# EAGLE design MasterHMI (EAGLE 9.3.2)
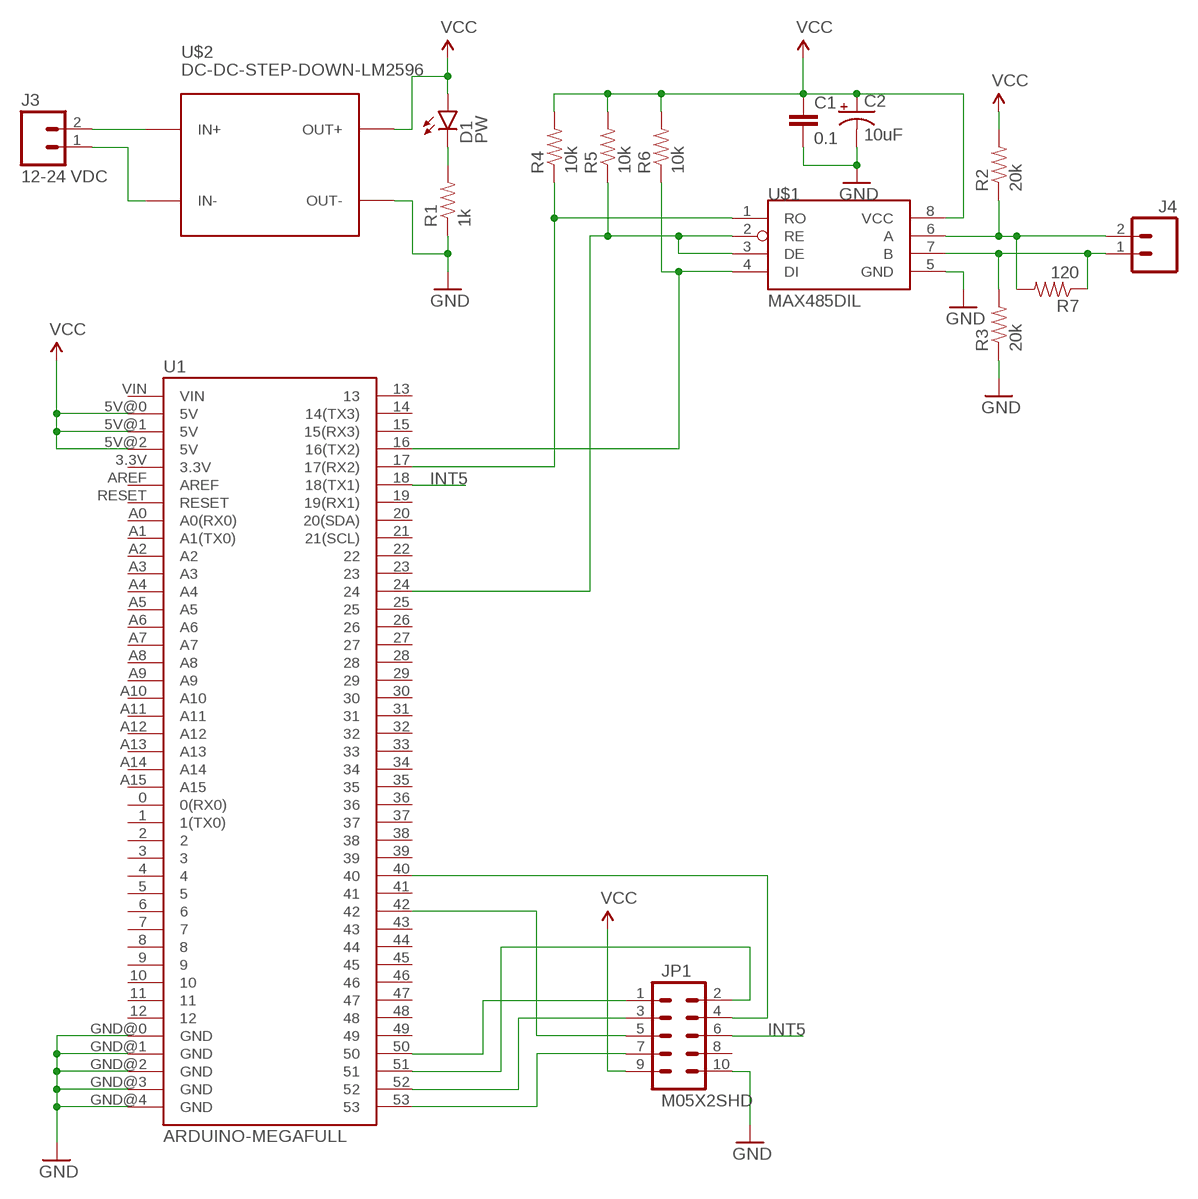
[diagram p0: schematic, sheet 1]

## Parts
C1  0.1  CAPPTH1  [CAP-PTH-5MM]
C2  10uF  CAP_POLPTH2  [CPOL-RADIAL-10UF-25V]
D1  PW  LED3MM  [LED3MM]
J3  12-24 VDC  M025MM  [SCREWTERMINAL-5MM-2]
J4  M025MM  [SCREWTERMINAL-5MM-2]
JP1  M05X2SHD  [2X5-SHROUDED]
R1  1k  RESISTORAXIAL-0.3  [AXIAL-0.3]
R2  20k  RESISTORAXIAL-0.3  [AXIAL-0.3]
R3  20k  RESISTORAXIAL-0.3  [AXIAL-0.3]
R4  10k  RESISTORAXIAL-0.3  [AXIAL-0.3]
R5  10k  RESISTORAXIAL-0.3  [AXIAL-0.3]
R6  10k  RESISTORAXIAL-0.3  [AXIAL-0.3]
R7  120  RESISTORAXIAL-0.3  [AXIAL-0.3]
U1  ARDUINO-MEGAFULL  [ARDUINO_MEGA]
U$1  MAX485DIL  [DIL08]
U$2  DC-DC-STEP-DOWN-LM2596  [DC-DC-STEP-DOWN-LM2596]

## Nets
GND: C1.2 C2.2(-) JP1.10 R1.P$1 R3.P$1 U1.GND@0(GND) U1.GND@1(GND) U1.GND@2(GND) U1.GND@3(GND) U1.GND@4(GND) U$1.5(GND) U$2.OUT-
INT5: JP1.6 U1.18(18(TX1))
N$1: J3.2 U$2.IN+
N$2: J3.1 U$2.IN-
N$3: J4.2 R2.P$1 R7.P$2 U$1.6(A)
N$4: J4.1 R3.P$2 R7.P$1 U$1.7(B)
N$5: D1.K(C) R1.P$2
N$6: JP1.1 U1.50
N$7: JP1.2 U1.51
N$8: R4.P$1 U1.17(17(RX2)) U$1.1(RO)
N$9: R6.P$1 U1.16(16(TX2)) U$1.4(DI)
N$10: JP1.3 U1.52
N$12: JP1.7 U1.53
N$13: JP1.5 U1.42
N$14: R5.P$1 U1.24 U$1.2(RE) U$1.3(DE)
N$15: JP1.4 U1.40
VCC: C1.1 C2.1(+) D1.A JP1.9 R2.P$2 R4.P$2 R5.P$2 R6.P$2 U1.5V@0(5V) U1.5V@1(5V) U1.5V@2(5V) U$1.8(VCC) U$2.OUT+
Unconnected: JP1.8 U1.0(0(RX0)) U1.1(1(TX0)) U1.2 U1.3 U1.3.3V U1.4 U1.5 U1.6 U1.7 U1.8 U1.9 U1.10 U1.11 U1.12 U1.13 U1.14(14(TX3)) U1.15(15(RX3)) U1.19(19(RX1)) U1.20(20(SDA)) U1.21(21(SCL)) U1.22 U1.23 U1.25 U1.26 U1.27 U1.28 U1.29 U1.30 U1.31 U1.32 U1.33 U1.34 U1.35 U1.36 U1.37 U1.38 U1.39 U1.41 U1.43 U1.44 U1.45 U1.46 U1.47 U1.48 U1.49 U1.A0(A0(RX0)) U1.A1(A1(TX0)) U1.A2 U1.A3 U1.A4 U1.A5 U1.A6 U1.A7 U1.A8 U1.A9 U1.A10 U1.A11 U1.A12 U1.A13 U1.A14 U1.A15 U1.AREF U1.RESET U1.VIN

## Library data of the parts
C1 = SparkFun-Capacitors:CAP: Capacitor Standard 0603 ceramic capacitor, and 0.1" leaded capacitor.
C2 = SparkFun-Capacitors:CAP_POL: Capacitor Polarized These are standard SMD and PTH capacitors. Normally 10uF, 47uF, and 100uF in electrolytic and tantalum varieties. Always verify the external diameter of the through hole cap, it varies with capacity, voltage, and manufacturer. The EIA devices should be standard.
D1 = SparkFun-LED:LED: LEDs Standard schematic elements and footprints for 5mm, 3mm, 1206, and 0603 sized LEDs. 5mm - Spark Fun Electronics SKU : COM-00529 (and others); PROD_ID: DIO-08794
J3 J4 = SparkFun-Connectors:M02: Standard 2-pin 0.1" header. Use with - straight break away headers ( PRT-00116) - right angle break away headers (PRT-00553) - swiss pins (PRT-00743) - machine pins (PRT-00117) - female headers (PRT-00115) Molex polarized connector foot print use with: PRT-08233 with associated crimp pins and housings. 2.54_SCREWTERM for use with PRT-10571. 3.5mm Screw Terminal footprints for PRT-08084 5mm Screw Terminal footprints for use with PRT-08432; STOREFRONT_ID: PRT-08432
JP1 = SparkFun:M05X2: Header 5x2 Standard 10-pin dual row 0.1" header. Commonly used with AVR-ISP. Use with Spark Fun Electronics SKU: PRT-00778
R1-R7 = SparkFun:RESISTOR: Resistor Basic schematic elements and footprints for 0603, 1206, and PTH resistors.
U1 = SparkFun-Boards:ARDUINO-MEGA: Arduino Mega board footprint
U$1 = SparkFun:MAX485
U$2 = diy-modules:DC-DC-STEP-DOWN-LM2596: DC/DC Step-Down Regulator based on LM2596-ADJ chip LM2596 datasheet available here: http://www.ti.com/lit/ds/symlink/lm2596.pdf Click here to find device on ebay.com <http://www.ebay.com/sch/lm2596+power+regulator>

## Board
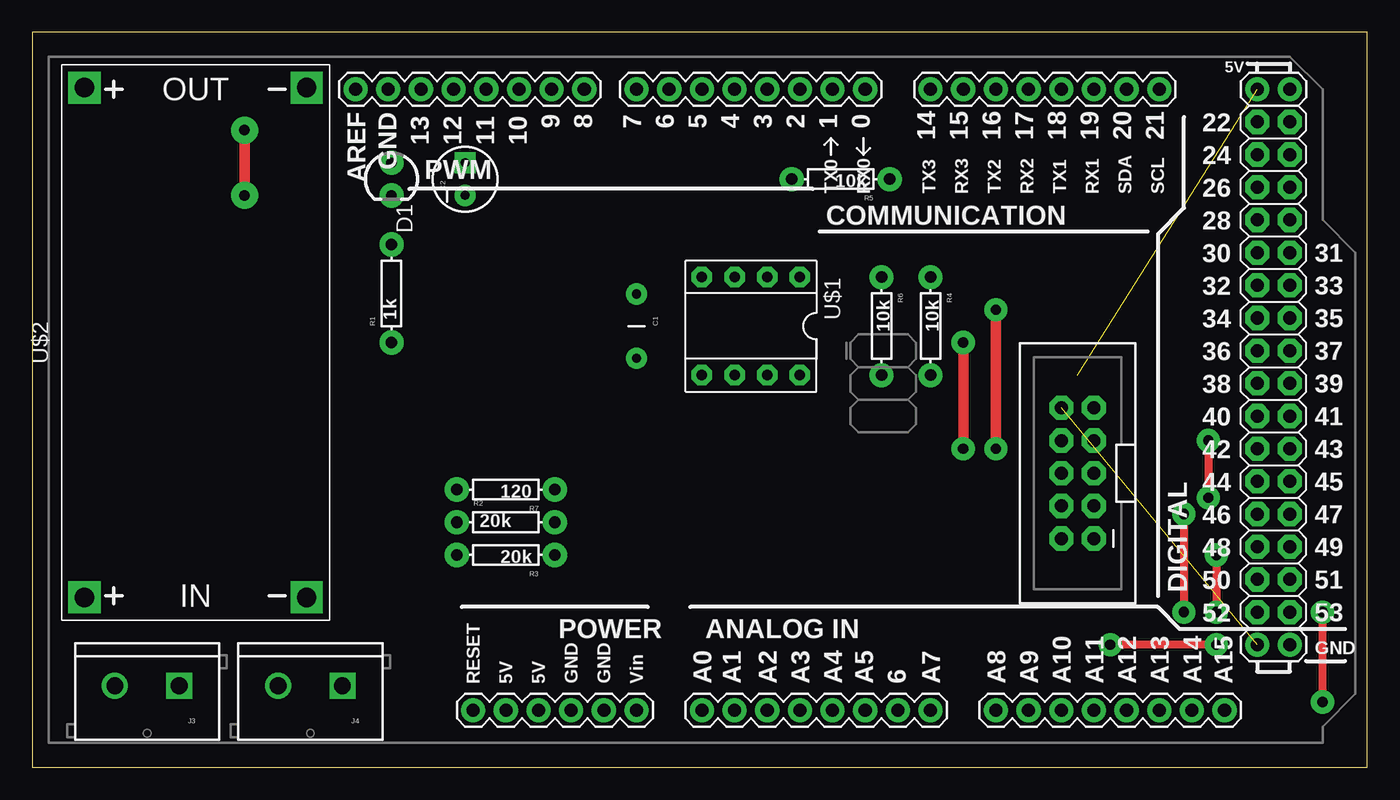
[diagram p1: board, top side]
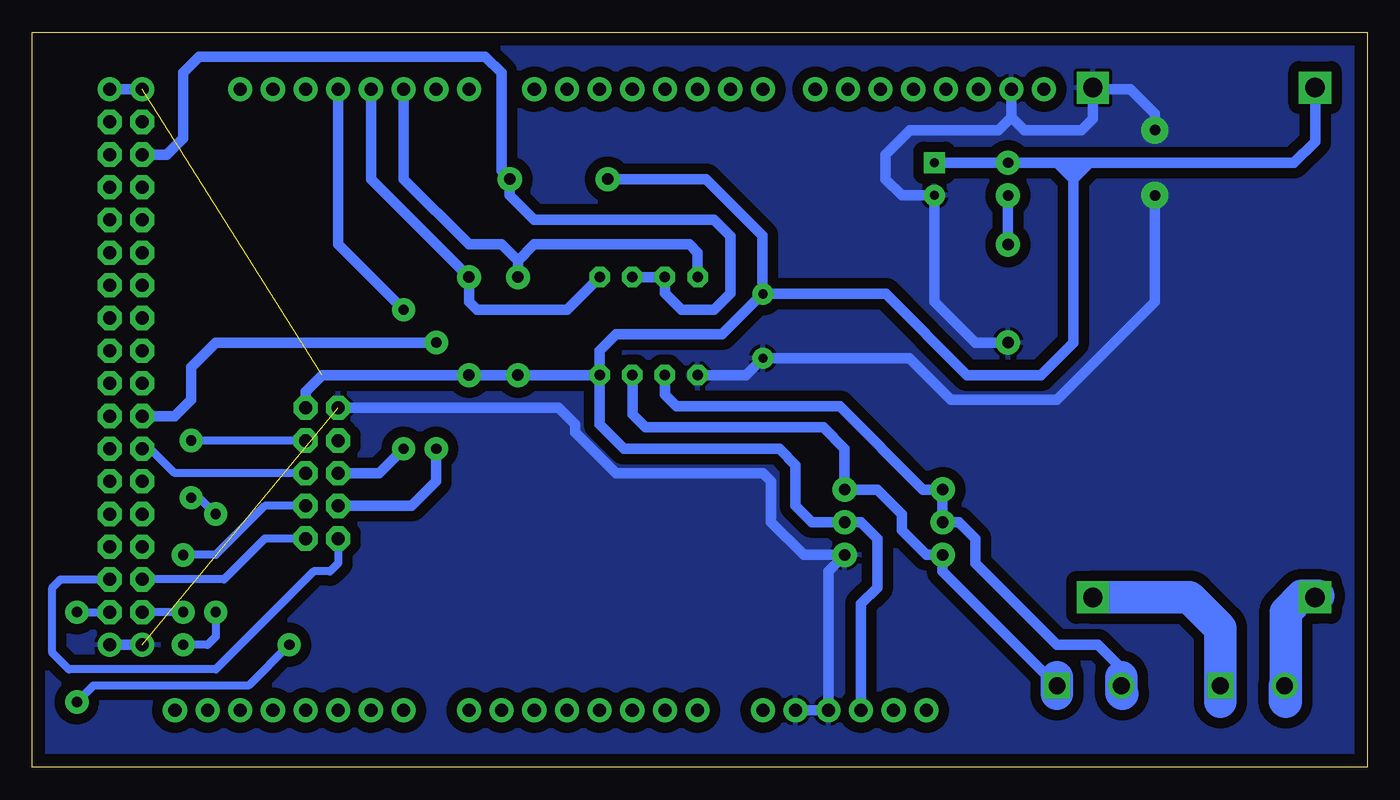
[diagram p2: board, bottom side, seen from below]

Size 103.81 x 57.14 mm. Coordinates in mm from the lower left corner, seen from the top.
Outline: 0,0 103.81,0 103.81,57.14 0,57.14 0,0
Copper layers (1*16): Top 0.035mm / dielectric 1.5mm / Bottom 0.035mm
Design rules "default": minimum track width 6mil, minimum drill 0.35mm, track to track 6mil, track to pad 6mil, pad to pad 6mil, via to via 6mil, smd to smd 6mil, copper to edge 40mil, drill to drill 6mil, minimum pad ring 10mil, minimum via ring 8mil, stop-mask expansion 4mil, vias tented up to drill 0mil, thermal gap 10mil

### Footprints (pad centres in the part's own frame; a part is rotated, then mirrored left to right if it is on the bottom)
CAP-PTH-5MM = drill 0.7 pad 1.651: 1 -2.5,0; 2 2.5,0
CPOL-RADIAL-10UF-25V = drill 0.7 pad 1.651 square: 1 1.27,0 | drill 0.7 pad 1.651: 2 -1.27,0
LED3MM = drill 0.813 pad 1.88: A -1.27,0; K 1.27,0
SCREWTERMINAL-5MM-2 = drill 1.3 pad 2.032 square: 1 0,0 | drill 1.3 pad 2.032: 2 5,0
2X5-SHROUDED = drill 1.016 pad 1.88 octagon: 1 -1.27,5.08; 2 1.27,5.08; 3 -1.27,2.54; 4 1.27,2.54; 5 -1.27,0; 6 1.27,0; 7 -1.27,-2.54; 8 1.27,-2.54; 9 -1.27,-5.08; 10 1.27,-5.08
AXIAL-0.3 = drill 0.9 pad 1.88: P$1 -3.81,0; P$2 3.81,0
ARDUINO_MEGA = drill 1.016 pad 1.88: 0 63.5,50.8; 1 60.96,50.8; 2 58.42,50.8; 3 55.88,50.8; 3.3V 35.56,2.54; 4 53.34,50.8; 5 50.8,50.8; 5V@0 38.1,2.54; 5V@1 93.98,50.8; 5V@2 96.52,50.8; 6 48.26,50.8; 7 45.72,50.8; 8 41.656,50.8; 9 39.116,50.8; 10 36.576,50.8; 11 34.036,50.8; 12 31.496,50.8; 13 28.956,50.8; 14 68.58,50.8; 15 71.12,50.8; 16 73.66,50.8; 17 76.2,50.8; 18 78.74,50.8; 19 81.28,50.8; 20 83.82,50.8; 21 86.36,50.8; A0 50.8,2.54; A1 53.34,2.54; A2 55.88,2.54; A3 58.42,2.54; A4 60.96,2.54; A5 63.5,2.54; A6 66.04,2.54; A7 68.58,2.54; A8 73.66,2.54; A9 76.2,2.54; A10 78.74,2.54; A11 81.28,2.54; A12 83.82,2.54; A13 86.36,2.54; A14 88.9,2.54; A15 91.44,2.54; AREF 23.876,50.8; GND@0 40.64,2.54; GND@1 43.18,2.54; GND@2 93.98,7.62; GND@3 96.52,7.62; GND@4 26.416,50.8; RESET 33.02,2.54; VIN 45.72,2.54 | drill 1.016 pad 1.88 octagon: 22 93.98,48.26; 23 96.52,48.26; 24 93.98,45.72; 25 96.52,45.72; 26 93.98,43.18; 27 96.52,43.18; 28 93.98,40.64; 29 96.52,40.64; 30 93.98,38.1; 31 96.52,38.1; 32 93.98,35.56; 33 96.52,35.56; 34 93.98,33.02; 35 96.52,33.02; 36 93.98,30.48; 37 96.52,30.48; 38 93.98,27.94; 39 96.52,27.94; 40 93.98,25.4; 41 96.52,25.4; 42 93.98,22.86; 43 96.52,22.86; 44 93.98,20.32; 45 96.52,20.32; 46 93.98,17.78; 47 96.52,17.78; 48 93.98,15.24; 49 96.52,15.24; 50 93.98,12.7; 51 96.52,12.7; 52 93.98,10.16; 53 96.52,10.16
DIL08 = drill 0.813 pad 1.6 octagon: 1 -3.81,-3.81; 2 -1.27,-3.81; 3 1.27,-3.81; 4 3.81,-3.81; 5 3.81,3.81; 6 1.27,3.81; 7 -1.27,3.81; 8 -3.81,3.81
DC-DC-STEP-DOWN-LM2596 = drill 1.5 pad 2.5 square: IN+ -19.812,8.636; IN- -19.812,-8.636; OUT+ 19.812,8.636; OUT- 19.812,-8.636

### Placement (x,y rotation side)
C1  46.99,34.29 270 top
C2  33.66,45.72 90 top
D1  27.94,45.72 270 top
J3  11.43,6.35 180 top
J4  24.13,6.35 180 top
JP1  81.28,22.86 180 top
R1  27.94,36.83 90 top
R2  36.83,19.05 0 top
R3  36.83,16.51 180 top
R4  69.85,34.29 270 top
R5  62.87,45.72 180 top
R6  66.04,34.29 270 top
R7  36.83,21.59 180 top
U1  1.27,1.91 0 top
U$1  55.88,34.29 180 top
U$2  12.7,33.02 90 top

### Tracks (layer width: path | path; a pad name or v marks a point on that pad's centre or on a via)
GND  (via drill 0.8 pad 2.1)  (1 unrouted)
  Top 0.813: v16.51,44.45 v16.51,49.53
  Bottom 0.813: U$1.5 48.3,30.48 C1.2 35.6,31.79 32.38,28.57 24.13,28.57 16.51,36.2 v16.51,44.45 | R1.P$1 30.48,33.02 33.66,36.2 C2.2 36.2,44.45 37.46,45.72 37.46,47.62 35.56,49.53 28.7,49.53 27.69,50.55 | v16.51,49.53 16.51,50.8 18.41,52.7 21.34,52.7 U$2.OUT- 21.34,50.42 22.23,49.53 26.67,49.53 27.69,50.55 | 27.69,50.55 U1.GND@4 | U1.GND@1 U1.GND@0 41.91,15.24 R3.P$1 43.81,16.51 46.35,19.05 46.35,22.23 46.99,22.86 58.42,22.86 61.59,26.04 61.59,26.67 62.87,27.94 JP1.10 | U1.GND@3 U1.GND@2
  pour Bottom (isolate 0.813): 0,57.15 104.14,57.15 104.14,0 0,0
INT5  (via drill 0.8 pad 1.8)
  Top 0.813: v74.93,24.77 v74.93,35.56
  Bottom 0.813: JP1.6 76.84,22.86 v74.93,24.77 | v74.93,35.56 80.01,40.64 U1.18
N$1
  Bottom 2.54: J3.2 6.43,5.16 6.35,5.08 6.35,12.07 5.08,13.34 3.94,13.34 | 3.81,13.34 3.94,13.34 | 3.94,13.34 U$2.IN+
N$2
  Bottom 2.54: 11.43,5.08 J3.1 11.43,10.8 13.84,13.21 U$2.IN-
N$3
  Bottom 0.813: 19.13,6.99 19.13,7.7 20.95,9.52 24.13,9.52 30.48,15.88 30.48,17.78 31.75,19.05 R2.P$1 | R2.P$1 R7.P$2 34.54,21.59 41.02,28.07 53.72,28.07 54.61,28.96 U$1.6 | 33.02,19.69 R2.P$1
  Bottom 2.54: 19.13,6.99 J4.2 19.13,5.8 19.05,5.72
N$4
  Bottom 0.813: J4.1 33.02,15.24 R3.P$2 34.29,16.51 36.2,18.41 36.2,19.69 38.1,21.59 R7.P$1 40.64,24.77 42.29,26.42 56.13,26.42 57.15,27.43 U$1.7
  Bottom 2.54: 24.13,6.99 J4.1 24.13,5.72
N$5
  Bottom 0.813: D1.K R1.P$2
N$6
  Bottom 0.61: JP1.1 85.73,17.78 88.9,14.61 U1.50
N$7
  Bottom 0.61: JP1.2 80.01,15.88 80.65,15.24 81.92,15.24 89.54,7.62 100.97,7.62 102.23,8.89 102.23,13.97 101.6,14.61 U1.51
N$8
  Bottom 0.813: U$1.1 62.23,35.56 69.22,35.56 69.85,36.2 R4.P$1 77.47,45.72 U1.17
N$9
  Bottom 0.813: 66.04,39.37 R6.P$1 | U$1.4 52.07,40.01 52.7,40.64 64.77,40.64 66.04,39.37 | 66.04,39.37 67.31,40.64 69.85,40.64 74.93,45.72 U1.16
N$10  (via drill 0.8 pad 1.8)
  Top 0.61: v92.08,16.51 v92.08,12.07
  Bottom 0.61: JP1.3 85.73,20.32 89.54,16.51 v92.08,16.51 | v92.08,12.07 U1.52
N$12  (via drill 0.8 pad 1.8)
  Top 0.61: v91.44,25.4 v91.44,20.96 | v89.54,19.69 v89.54,12.07 | v92.08,9.52 v83.82,9.52 | v100.33,5.08 v100.33,12.07
  Bottom 0.61: JP1.7 v91.44,25.4 | v91.44,20.96 90.81,20.96 v89.54,19.69 | v89.54,12.07 89.54,10.16 90.17,9.52 v92.08,9.52 | v83.82,9.52 87,6.35 99.06,6.35 v100.33,5.08 | v100.33,12.07 U1.53
N$13
  Bottom 0.61: JP1.5 92.71,22.86 94.62,24.77 U1.42
N$14
  Bottom 0.813: U$1.2 U$1.3 54.61,36.83 53.34,35.56 50.8,35.56 49.53,36.83 49.53,41.27 50.8,42.55 64.77,42.55 66.68,44.45 R5.P$1 67.31,46.36 67.31,53.98 68.58,55.24 90.81,55.24 92.08,53.98 92.08,48.9 93.34,47.62 U1.24
N$15  (via drill 0.8 pad 1.8)
  Top 0.813: v72.39,33.02 v72.39,24.77
  Bottom 0.813: JP1.4 74.3,20.32 72.39,22.23 v72.39,24.77 | v72.39,33.02 89.54,33.02 91.44,31.12 91.44,28.57 92.71,27.3 U1.40
VCC  (1 unrouted)
  Bottom 0.813: U$1.8 R6.P$2 R4.P$2 81.28,30.48 82.55,29.21 JP1.9 | U$1.8 59.69,32.38 58.42,33.66 50.16,33.66 47.03,36.79 | 47.03,36.79 C1.1 37.42,36.79 31.12,30.48 25.4,30.48 22.86,33.02 22.86,45.72 | U$2.OUT+ 4.06,48.64 5.71,46.99 21.59,46.99 | 21.59,46.99 22.86,46.99 | 22.86,46.99 24.13,46.99 | 24.13,46.99 D1.A C2.1 | 47.03,36.79 47.03,41.31 51.43,45.72 R5.P$2 | 22.86,45.72 22.86,46.99 | 22.86,45.72 21.59,46.99 | 22.86,45.72 24.13,46.99 | U1.5V@0 39.37,12.7 38.1,13.97 38.1,17.78 39.37,19.05 R2.P$2 43.18,19.05 44.45,20.32 44.45,23.5 45.72,24.77 57.79,24.77 59.69,26.67 U$1.8 | U1.5V@2 U1.5V@1